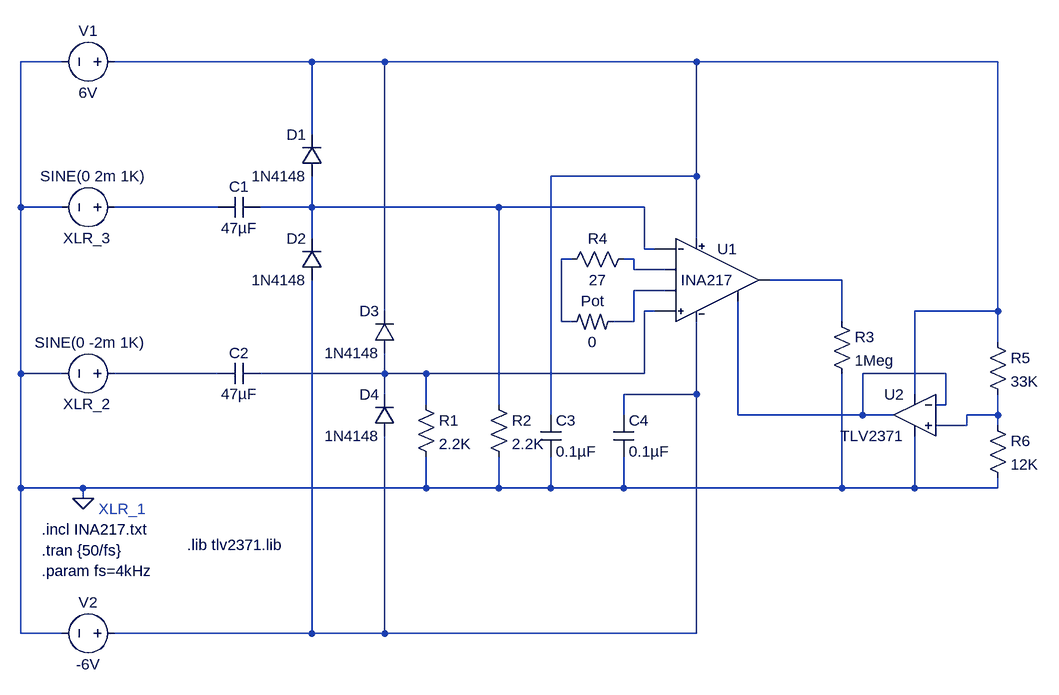
[diagram p0: schematic Ina217 Mic.asc]
Ina217 Mic.asc, the LTspice schematic file:
Version 4.1
SHEET 1 1684 680
WIRE -224 -352 -288 -352
WIRE 160 -352 -144 -352
WIRE 272 -352 160 -352
WIRE 752 -352 272 -352
WIRE 1216 -352 752 -352
WIRE 160 -240 160 -352
WIRE 752 -176 752 -352
WIRE 752 -176 528 -176
WIRE -288 -128 -288 -352
WIRE -224 -128 -288 -128
WIRE 16 -128 -144 -128
WIRE 160 -128 160 -176
WIRE 160 -128 80 -128
WIRE 448 -128 160 -128
WIRE 672 -128 448 -128
WIRE 160 -80 160 -128
WIRE 752 -80 752 -176
WIRE 672 -64 672 -128
WIRE 688 -64 672 -64
WIRE 560 -48 544 -48
WIRE 656 -48 640 -48
WIRE 656 -32 656 -48
WIRE 704 -32 656 -32
WIRE 976 -16 864 -16
WIRE 704 0 656 0
WIRE 272 32 272 -352
WIRE 688 32 672 32
WIRE 1216 32 1216 -352
WIRE 1216 32 1088 32
WIRE 544 48 544 -48
WIRE 560 48 544 48
WIRE 656 48 656 0
WIRE 656 48 624 48
WIRE 976 48 976 -16
WIRE 1216 80 1216 32
WIRE -288 128 -288 -128
WIRE -224 128 -288 128
WIRE 16 128 -144 128
WIRE 272 128 272 96
WIRE 272 128 80 128
WIRE 336 128 272 128
WIRE 672 128 672 32
WIRE 672 128 336 128
WIRE 1136 128 1008 128
WIRE 272 160 272 128
WIRE 752 160 752 48
WIRE 752 160 640 160
WIRE 1088 160 1088 32
WIRE 336 176 336 128
WIRE 448 176 448 -128
WIRE 1136 176 1136 128
WIRE 1136 176 1120 176
WIRE 528 192 528 -176
WIRE 640 192 640 160
WIRE 816 192 816 16
WIRE 1008 192 1008 128
WIRE 1008 192 816 192
WIRE 1056 192 1008 192
WIRE 1216 192 1216 160
WIRE 1216 192 1168 192
WIRE 1168 208 1168 192
WIRE 1168 208 1120 208
WIRE 1216 208 1216 192
WIRE -288 304 -288 128
WIRE -192 304 -288 304
WIRE 336 304 336 256
WIRE 336 304 -192 304
WIRE 448 304 448 256
WIRE 448 304 336 304
WIRE 528 304 528 256
WIRE 528 304 448 304
WIRE 640 304 640 256
WIRE 640 304 528 304
WIRE 976 304 976 128
WIRE 976 304 640 304
WIRE 1088 304 1088 224
WIRE 1088 304 976 304
WIRE 1216 304 1216 288
WIRE 1216 304 1088 304
WIRE -192 320 -192 304
WIRE -288 528 -288 304
WIRE -224 528 -288 528
WIRE 160 528 160 -16
WIRE 160 528 -144 528
WIRE 272 528 272 224
WIRE 272 528 160 528
WIRE 752 528 752 160
WIRE 752 528 272 528
FLAG -192 320 0
SYMBOL INA217 784 -16 R0
SYMATTR InstName U1
SYMBOL voltage -128 -128 R90
WINDOW 0 47 21 VRight 2
WINDOW 3 -48 -32 VRight 2
WINDOW 123 0 0 Left 0
WINDOW 39 0 0 Left 0
SYMATTR InstName XLR_3
SYMATTR Value SINE(0 2m 1K)
SYMBOL voltage -128 128 R90
WINDOW 0 47 21 VRight 2
WINDOW 3 -48 -32 VRight 2
WINDOW 123 0 0 Left 0
WINDOW 39 0 0 Left 0
SYMATTR InstName XLR_2
SYMATTR Value SINE(0 -2m 1K)
SYMBOL cap 80 -144 R90
WINDOW 0 0 32 VBottom 2
WINDOW 3 32 32 VTop 2
SYMATTR InstName C1
SYMATTR Value 47µF
SYMATTR SpiceLine V=63 Irms=7m Rser=1.1484 Lser=1.843n
SYMBOL cap 80 112 R90
WINDOW 0 0 32 VBottom 2
WINDOW 3 32 32 VTop 2
SYMATTR InstName C2
SYMATTR Value 47µF
SYMATTR SpiceLine V=25 Irms=0 Rser=0.014 Lser=1000p
SYMBOL voltage -128 -352 R90
WINDOW 0 -32 56 VBottom 2
WINDOW 3 32 56 VTop 2
WINDOW 123 0 0 Left 0
WINDOW 39 0 0 Left 0
SYMATTR InstName V1
SYMATTR Value 6V
SYMBOL voltage -128 528 R90
WINDOW 0 -32 56 VBottom 2
WINDOW 3 32 56 VTop 2
SYMATTR InstName V2
SYMATTR Value -6V
SYMBOL diode 176 -176 R180
WINDOW 0 24 64 Left 2
WINDOW 3 24 0 Left 2
SYMATTR InstName D1
SYMATTR Value 1N4148
SYMBOL diode 176 -16 R180
WINDOW 0 24 64 Left 2
WINDOW 3 24 0 Left 2
SYMATTR InstName D2
SYMATTR Value 1N4148
SYMBOL diode 288 96 R180
WINDOW 0 24 64 Left 2
WINDOW 3 24 0 Left 2
SYMATTR InstName D3
SYMATTR Value 1N4148
SYMBOL diode 288 224 R180
WINDOW 0 24 64 Left 2
WINDOW 3 24 0 Left 2
SYMATTR InstName D4
SYMATTR Value 1N4148
SYMBOL res 320 160 R0
SYMATTR InstName R1
SYMATTR Value 2.2K
SYMBOL res 432 160 R0
SYMATTR InstName R2
SYMATTR Value 2.2K
SYMBOL cap 512 192 R0
SYMATTR InstName C3
SYMATTR Value 0.1µF
SYMBOL cap 624 192 R0
SYMATTR InstName C4
SYMATTR Value 0.1µF
SYMBOL res 960 32 R0
SYMATTR InstName R3
SYMATTR Value 1Meg
SYMBOL res2 560 64 R270
WINDOW 0 32 32 VTop 2
WINDOW 3 0 32 VBottom 2
SYMATTR InstName Pot
SYMATTR Value 0
SYMBOL res 656 -64 R90
WINDOW 0 0 56 VBottom 2
WINDOW 3 32 56 VTop 2
SYMATTR InstName R4
SYMATTR Value 27
SYMBOL res 1200 64 R0
SYMATTR InstName R5
SYMATTR Value 33K
SYMBOL res 1200 192 R0
SYMATTR InstName R6
SYMATTR Value 12K
SYMBOL OpAmps\\opamp2 1088 128 M0
SYMATTR InstName U2
SYMATTR Value TLV2371
TEXT -256 400 Left 2 !.tran {50/fs}
TEXT -256 432 Left 2 !.param fs=4kHz
TEXT -256 368 Left 2 !.incl INA217.txt
TEXT -168 336 Left 2 ;XLR_1
TEXT -32 392 Left 2 !.lib tlv2371.lib

The netlist it stands for:
* Ina217 Mic.asc
X§U1 N008 N003 N001 N011 N006 N010 N005 N007 INA217  ; pins In+ In- ? ? ? ? ? ?
V§XLR_3 N002 0 SINE(0 2m 1K)
V§XLR_2 N009 0 SINE(0 -2m 1K)
C1 N003 N002 47µF V=63 Irms=7m Rser=1.1484 Lser=1.843n
C2 N008 N009 47µF V=25 Irms=0 Rser=0.014 Lser=1000p
V1 N001 0 6V
V2 N011 0 -6V
D1 N003 N001 1N4148
D2 N011 N003 1N4148
D3 N008 N001 1N4148
D4 N011 N008 1N4148
R1 N008 0 2.2K
R2 N003 0 2.2K
C3 N001 0 0.1µF
C4 N011 0 0.1µF
R3 N006 0 1Meg
R§Pot N004 N007 0
R4 N005 N004 27
R5 N001 N012 33K
R6 N012 0 12K
X§U2 N012 N010 N001 0 N010 TLV2371  ; pins In+ In- V+ V- OUT
.model D D
.lib standard.dio
.tran {50/fs}
.param fs=4kHz
.incl INA217.txt
* XLR_1
.lib tlv2371.lib
.lib INA217.txt
.backanno
.end